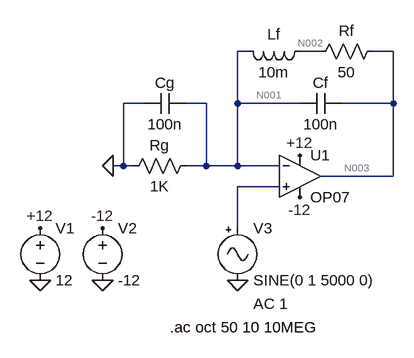
[diagram p0: schematic Draft1.asc]
Draft1.asc, the LTspice schematic file:
Version 4.1
SHEET 1 880 680
WIRE 128 -16 112 -16
WIRE 240 -16 208 -16
WIRE 352 -16 320 -16
WIRE -32 64 -64 64
WIRE 64 64 32 64
WIRE 112 64 112 -16
WIRE 208 64 112 64
WIRE 352 64 352 -16
WIRE 352 64 272 64
WIRE -64 160 -64 64
WIRE -64 160 -80 160
WIRE -48 160 -64 160
WIRE 64 160 64 64
WIRE 64 160 32 160
WIRE 112 160 112 64
WIRE 112 160 64 160
WIRE 176 160 112 160
WIRE 352 176 352 64
WIRE 352 176 240 176
WIRE 176 192 112 192
WIRE 112 256 112 192
FLAG -192 256 +12
FLAG 208 144 +12
FLAG -96 256 -12
FLAG 208 208 -12
FLAG -80 160 0
FLAG -192 336 0
FLAG -96 336 0
FLAG 112 336 0
SYMBOL OpAmps\\OP07 208 112 R0
SYMATTR InstName U1
SYMBOL cap 272 48 R90
WINDOW 0 0 32 VBottom 2
WINDOW 3 32 32 VTop 2
SYMATTR InstName Cf
SYMATTR Value 100n
SYMBOL cap 32 48 R90
WINDOW 0 0 32 VBottom 2
WINDOW 3 32 32 VTop 2
SYMATTR InstName Cg
SYMATTR Value 100n
SYMBOL res 48 144 R90
WINDOW 0 0 56 VBottom 2
WINDOW 3 32 56 VTop 2
SYMATTR InstName Rg
SYMATTR Value 1K
SYMBOL res 336 -32 R90
WINDOW 0 0 56 VBottom 2
WINDOW 3 32 56 VTop 2
SYMATTR InstName Rf
SYMATTR Value 50
SYMBOL ind 224 -32 R90
WINDOW 0 5 56 VBottom 2
WINDOW 3 32 56 VTop 2
SYMATTR InstName Lf
SYMATTR Value 10m
SYMBOL voltage -192 240 R0
WINDOW 123 0 0 Left 0
WINDOW 39 0 0 Left 0
SYMATTR InstName V1
SYMATTR Value 12
SYMBOL voltage -96 240 R0
WINDOW 123 0 0 Left 0
WINDOW 39 0 0 Left 0
SYMATTR InstName V2
SYMATTR Value -12
SYMBOL Misc\\signal 112 240 R0
WINDOW 123 24 132 Left 2
WINDOW 39 0 0 Left 0
SYMATTR InstName V3
SYMATTR Value SINE(0 1 5000 0)
SYMATTR Value2 AC 1
TEXT 8 408 Left 2 !.ac oct 50 10 10MEG

The netlist it stands for:
* Draft1.asc
X§U1 N004 N001 +12 -12 N003 LT1001  ; OP07, pins In+ In- V+ V- OUT
Cf N003 N001 100n
Cg N001 0 100n
Rg N001 0 1K
Rf N003 N002 50
Lf N002 N001 10m
V1 +12 0 12
V2 -12 0 -12
V3 N004 0 SINE(0 1 5000 0) AC 1
.ac oct 50 10 10MEG
.lib LTC.lib
.backanno
.end

* Results of the author's LTspice run, read from the files saved beside the schematic
* Operating Point, zero values left out:
*   V(-12) = -12 V
*   V(+12) = 12 V
*   I(V1) = -2.25 mA
*   I(V2) = 2.25 mA
*   Ix(u1:3) = 2.25 mA
*   Ix(u1:4) = -2.25 mA
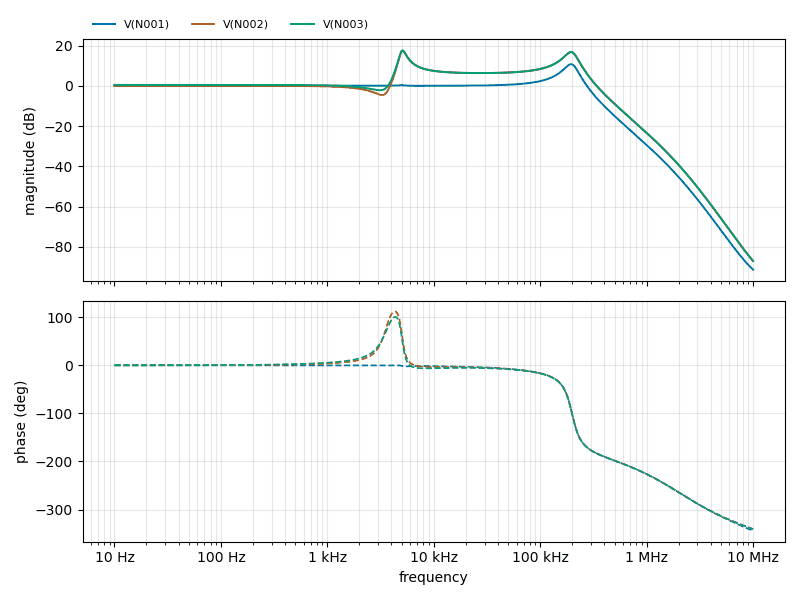
[diagram p1: AC Analysis of Draft1.asc, plotted from the saved traces]
* AC Analysis, 1 run:
*   V(N001): -0.00 dB at 10 Hz, -91.38 dB at 10 MHz, peak 10.74 dB at 196.2 kHz, 3 dB below the peak at 162.9 kHz and 222.2 kHz
*   V(N002): -0.00 dB at 10 Hz, -87.05 dB at 10 MHz, peak 17.34 dB at 5.12 kHz, 3 dB below the peak at 4.77 kHz and 5.633 kHz
*   V(N003): 0.42 dB at 10 Hz, -87.05 dB at 10 MHz, peak 17.58 dB at 5.12 kHz, 3 dB below the peak at 4.76 kHz and 5.615 kHz